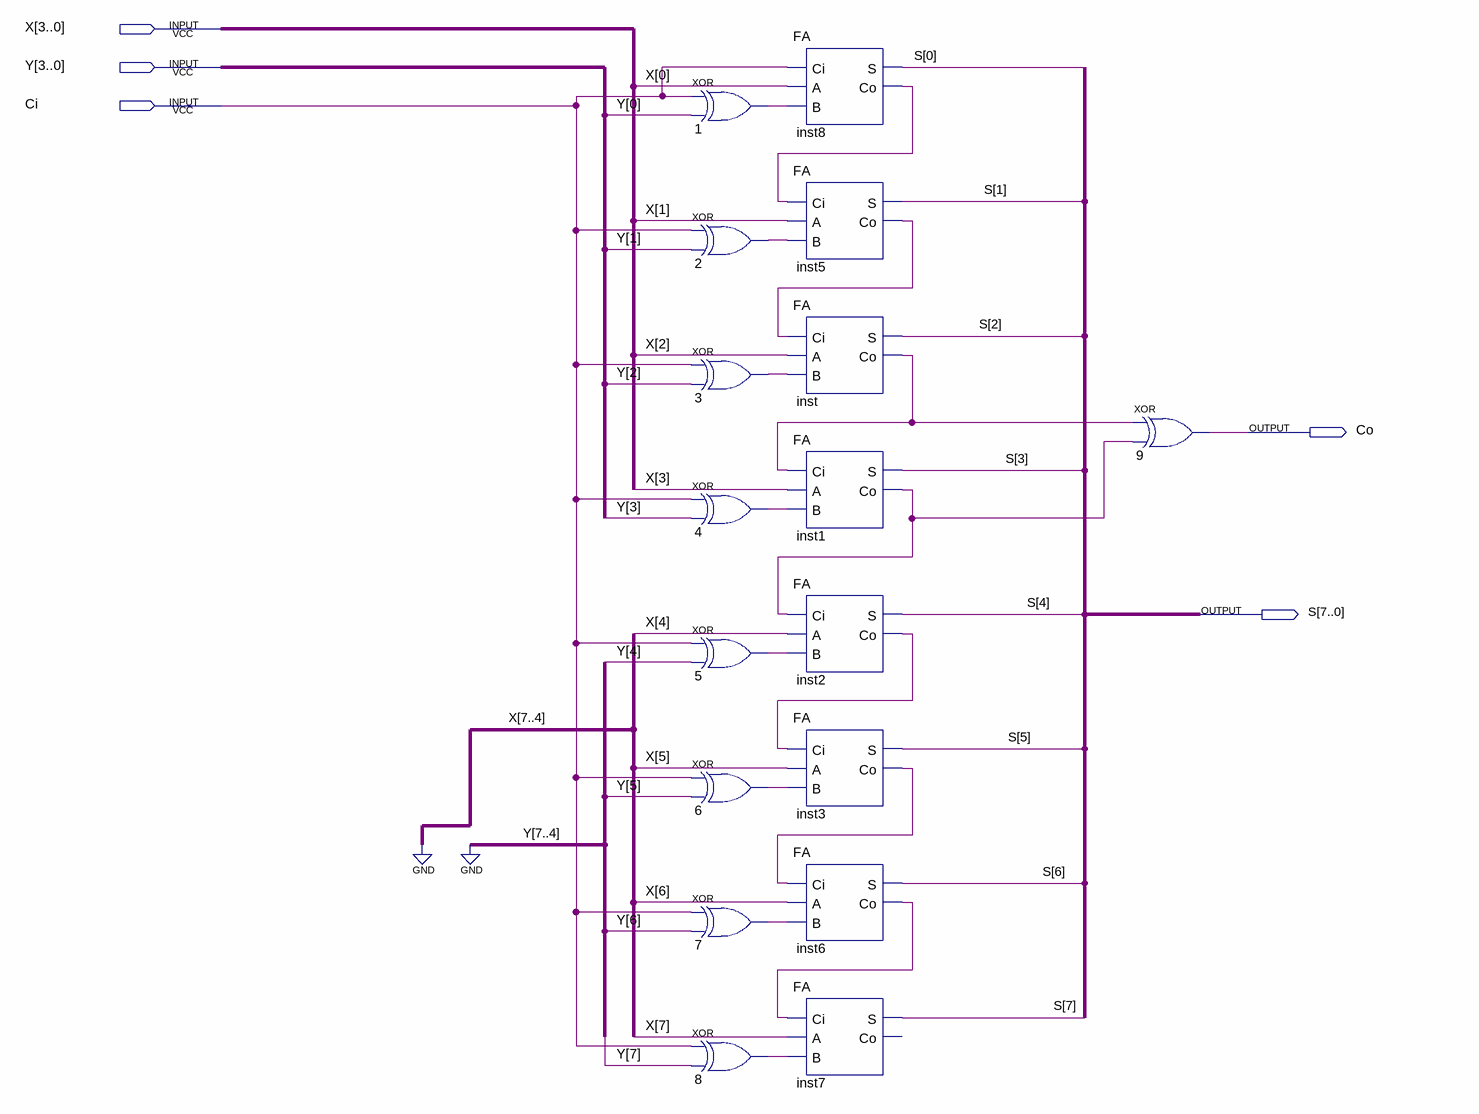
[diagram p0: schematic sheet]
// Quartus schematic Lab4.bdf as structural Verilog: 17 symbols, 5 pins
module Lab4 (
  input  [3:0] X,
  input  [3:0] Y,
  input  Ci,
  output Co,
  output [7:0] S
);

  wire inst1_co, inst2_co, inst3_co, inst5_co, inst6_co, inst8_co, inst_co, n1_out, n2_out, n3_out, n4_out,
       n5_out, n6_out, n7_out, n8_out;

  xor u_1 (n1_out, Ci, Y[0]);
  xor u_2 (n2_out, Ci, Y[1]);
  xor u_3 (n3_out, Ci, Y[2]);
  xor u_4 (n4_out, Ci, Y[3]);
  xor u_5 (n5_out, Ci, 1'b0);
  xor u_6 (n6_out, Ci, 1'b0);
  xor u_7 (n7_out, Ci, 1'b0);
  xor u_8 (n8_out, Ci, 1'b0);
  FA inst8 (.Ci(Ci), .A(X[0]), .B(n1_out), .S(S[0]), .Co(inst8_co));
  FA inst5 (.Ci(inst8_co), .A(X[1]), .B(n2_out), .S(S[1]), .Co(inst5_co));
  FA inst (.Ci(inst5_co), .A(X[2]), .B(n3_out), .S(S[2]), .Co(inst_co));
  FA inst1 (.Ci(inst_co), .A(X[3]), .B(n4_out), .S(S[3]), .Co(inst1_co));
  FA inst2 (.Ci(inst1_co), .A(1'b0), .B(n5_out), .S(S[4]), .Co(inst2_co));
  FA inst3 (.Ci(inst2_co), .A(1'b0), .B(n6_out), .S(S[5]), .Co(inst3_co));
  FA inst6 (.Ci(inst3_co), .A(1'b0), .B(n7_out), .S(S[6]), .Co(inst6_co));
  FA inst7 (.Ci(inst6_co), .A(1'b0), .B(n8_out), .S(S[7]));  // open: Co
  xor u_9 (Co, inst_co, inst1_co);
endmodule
